# EAGLE design PiGRRL_Zero_buttonpad (EAGLE 6.4)
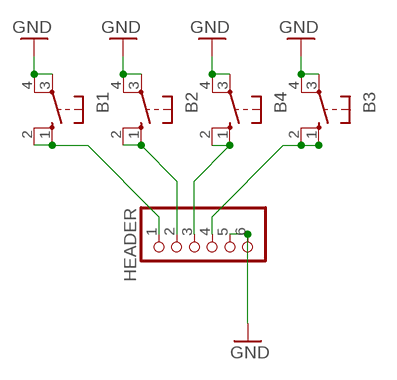
[diagram p0: schematic, sheet 1]

## Parts
B1  10-XX  [B3F-10XX]
B2  10-XX  [B3F-10XX]
B3  10-XX  [B3F-10XX]
B4  10-XX  [B3F-10XX]
HEADER  PINHD-1X6  [1X06]

## Nets
GND: B1.3(P) B1.4(P1) B2.3(P) B2.4(P1) B3.3(P) B3.4(P1) B4.3(P) B4.4(P1) HEADER.5 HEADER.6
N$1: B1.1(S) B1.2(S1) HEADER.1
N$2: B2.1(S) B2.2(S1) HEADER.2
N$3: B3.1(S) B3.2(S1) HEADER.4
N$4: B4.1(S) B4.2(S1) HEADER.3

## Library data of the parts
B1-B4 = switch-omron:10-XX: OMRON SWITCH; MPN: B3F-1000; OC_FARNELL: 176432; OC_NEWARK: 36M3542
HEADER = pinhead:PINHD-1X6: PIN HEADER

## Net classes
0 default: width 0.305 mm, drill 0.508 mm, clearance 0.254 mm

## Board
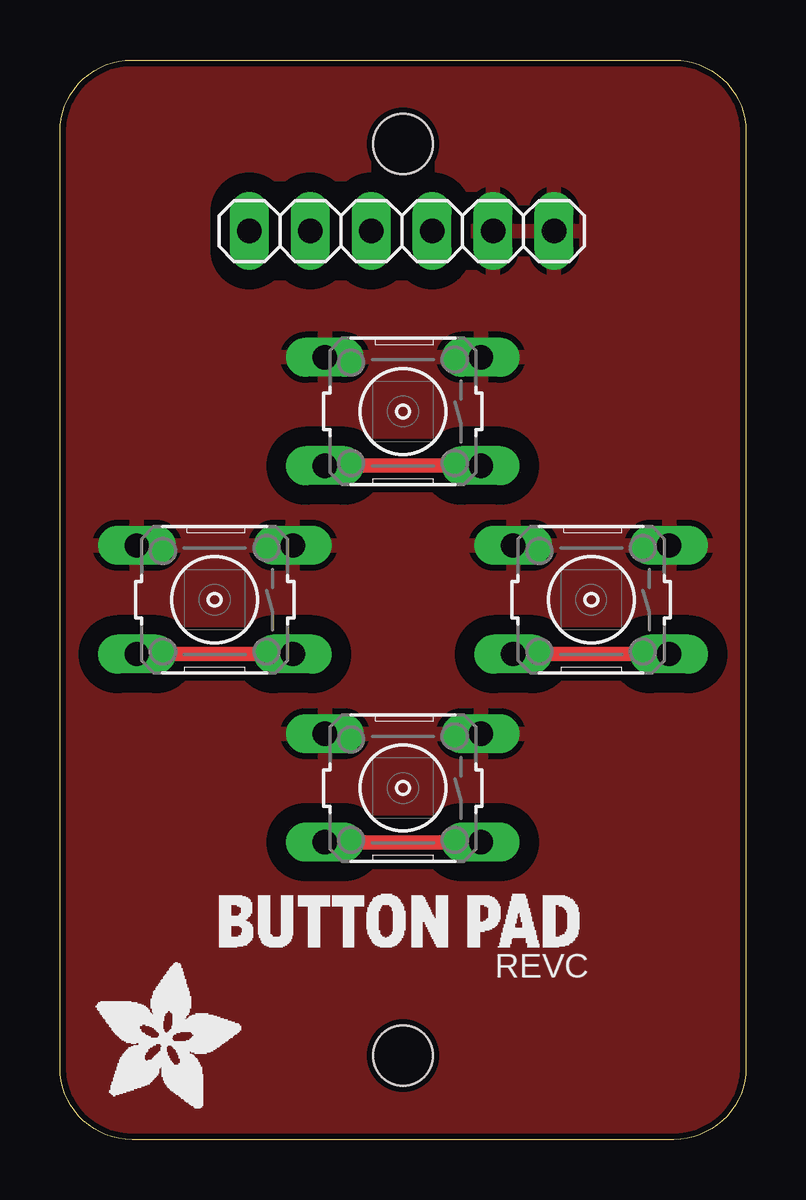
[diagram p1: board, top side]
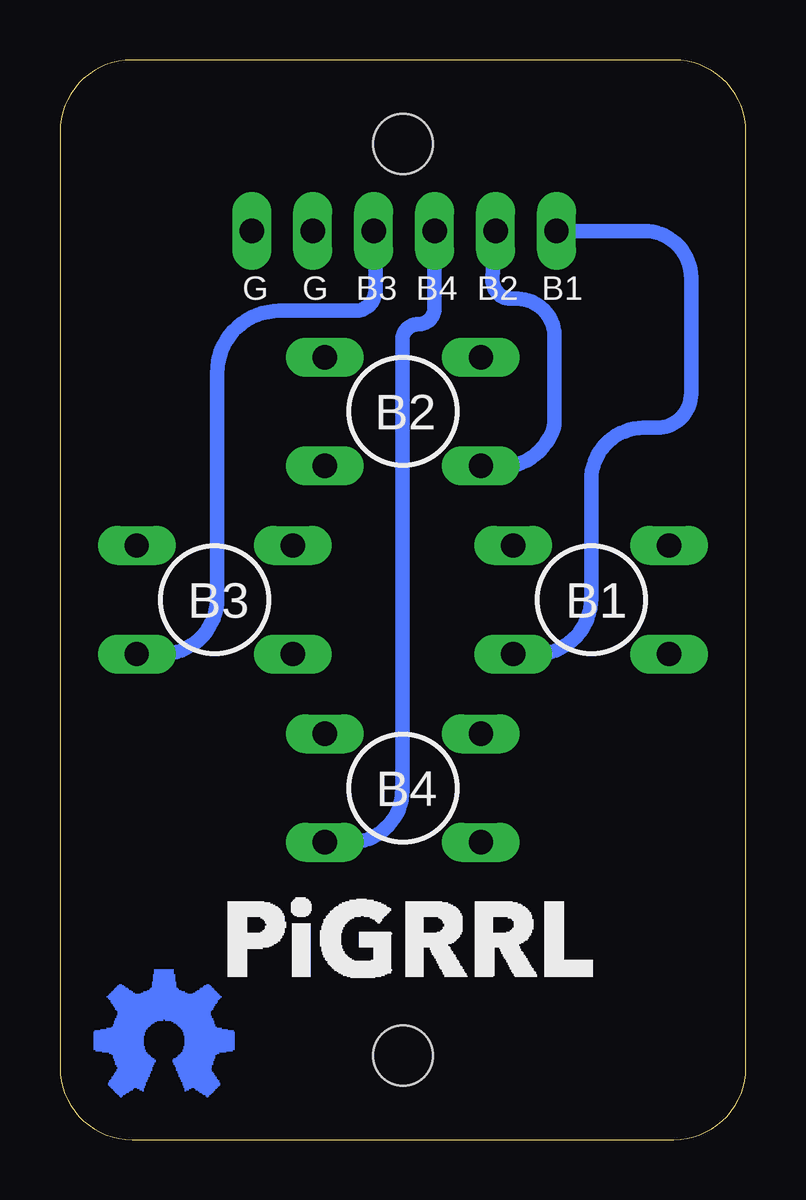
[diagram p2: board, bottom side, seen from below]

Size 28.6 x 45 mm. Coordinates in mm from the lower left corner, seen from the top.
Outline: 25.6,0 3,0 arc-90 0,3 0,42 arc-90 3,45 25.6,45 arc-90 28.6,42 28.6,3 arc-90 25.6,0
Copper layers (1*16): Top 0.035mm / dielectric 1.5mm / Bottom 0.035mm
Design rules "othermill_1_32": minimum track width 24mil, minimum drill 31mil, track to track 32mil, track to pad 32mil, pad to pad 32mil, via to via 32mil, smd to smd 8mil, copper to edge 10mil, drill to drill 8mil, minimum pad ring 12mil, minimum via ring 8mil, stop-mask expansion 2mil, vias tented up to drill 20mil, thermal gap 10mil
Holes 2.5 mm at 14.3,3.5 14.3,41.5

### Footprints (pad centres in the part's own frame; a part is rotated, then mirrored left to right if it is on the bottom)
B3F-10XX = drill 1.016 long: 1 -3.251,2.261; 2 3.251,2.261; 3 -3.251,-2.261; 4 3.251,-2.261
1X06 = drill 1.016 long: 1 -6.35,0; 2 -3.81,0; 3 -1.27,0; 4 1.27,0; 5 3.81,0; 6 6.35,0

### Placement (x,y rotation side)
B1  6.45,22.5 180 top
B2  14.3,30.35 180 top
B3  22.15,22.5 180 top
B4  14.3,14.65 180 top
HEADER  14.25,37.87 0 top

### Tracks (layer width: path | path; a pad name or v marks a point on that pad's centre or on a via)
GND
  pour Top: 3,45.26 25.5,45.26 arc-90 28.89,42 28.89,3 arc-90 25.5,-0.26 3,-0.26 arc-90 -0.26,3 -0.26,42 arc-90
N$1
  Top 0.61: B1.2 B1.1
  Bottom 0.61: B1.1 8.77,20.24 arc-90 6.45,22.55 6.45,27.48 arc90 4.27,29.67 3.71,29.67 arc-90 2.29,31.09 2.29,35.92 arc-90 4.24,37.87 HEADER.1
N$2
  Top 0.61: B2.2 B2.1
  Bottom 0.61: B2.2 10.82,28.09 arc-90 7.98,29.82 7.98,33.53 arc-90 9.65,35.05 9.8,35.05 arc90 10.57,35.81 10.52,37.39 arc90 HEADER.2
N$3
  Top 0.61: B3.2 B3.1
  Bottom 0.61: HEADER.4 arc90 15.44,37.8 15.44,35.41 arc90 16.31,34.54 19.46,34.54 arc-90 22.05,31.95 22.05,22.55 arc90 24.36,20.24 B3.1
N$4
  Top 0.61: B4.2 B4.1
  Bottom 0.61: B4.1 16.52,12.39 arc-90 14.33,14.58 14.33,33.33 arc90 13.66,33.98 arc-90 12.98,34.67 HEADER.3
(copper drawn outside any net)
  shapes: Bottom area x191

### Text on the board
tPlace: REVC
bPlace: B1 | B2 | B4 | B3 | G | G